# Altium schematic sheet Block Diagram.SchDoc: Gimbal - Block Diagram
size Letter; DrawnBy: Aidan Gratton; Organization: UW Robotics; Address1: 200 University Avenue; Address2: Waterloo; Address3: Ontario; Address4: Canada N2L 3G6; SheetNumber: 1
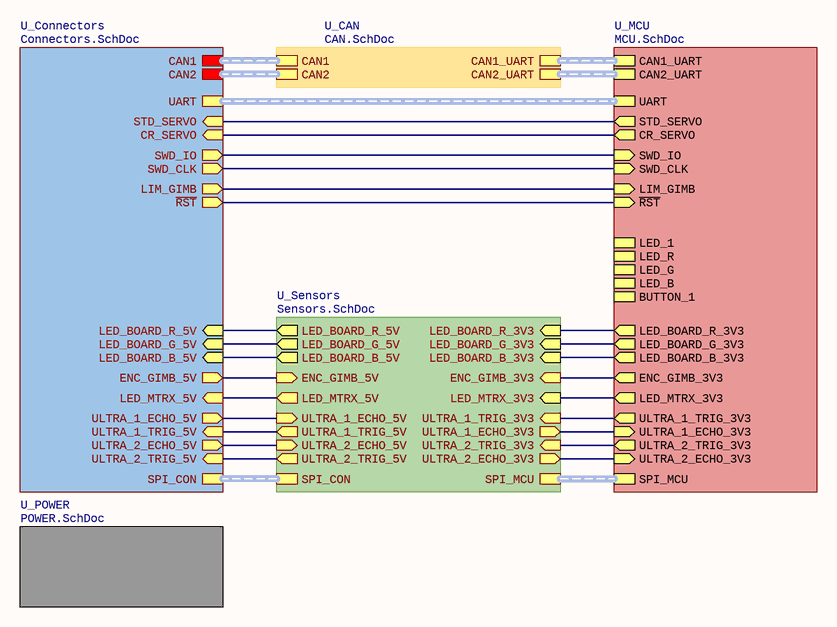
[diagram p0: Block Diagram.SchDoc]

## Sub-sheets
U_CAN = CAN.SchDoc: CAN1 (harness CAN1), CAN2 (harness CAN2), CAN2_UART (harness CAN2_UART), CAN1_UART (harness CAN1_UART)
U_Connectors = Connectors.SchDoc: ~{RST} (out), LIM_GIMB (out), LED_MTRX_5V (in), CAN1 (harness CAN1), CAN2 (harness CAN2), UART (harness UART), SPI_CON (harness SPI_CON), ENC_GIMB_5V (out), ULTRA_1_ECHO_5V (out), ULTRA_1_TRIG_5V (in), ULTRA_2_ECHO_5V (out), ULTRA_2_TRIG_5V (in), STD_SERVO (in), CR_SERVO (in), SWD_IO (out), SWD_CLK (out), LED_BOARD_R_5V (in), LED_BOARD_G_5V (in), LED_BOARD_B_5V (in)
U_MCU = MCU.SchDoc: ~{RST} (in), ENC_GIMB_3V3 (out), LIM_GIMB (in), UART (harness UART), CAN1_UART (harness CAN1_UART), CAN2_UART (harness CAN2_UART), SPI_MCU (harness SPI), LED_MTRX_3V3 (out), ULTRA_1_TRIG_3V3 (out), ULTRA_1_ECHO_3V3 (in), ULTRA_2_TRIG_3V3 (out), ULTRA_2_ECHO_3V3 (in), LED_1, LED_R, LED_G, LED_B, BUTTON_1, STD_SERVO (out), CR_SERVO (out), SWD_IO (in), SWD_CLK (in), LED_BOARD_R_3V3 (out), LED_BOARD_G_3V3 (out), LED_BOARD_B_3V3 (out)
U_POWER = POWER.SchDoc: no entries
U_Sensors = Sensors.SchDoc: ENC_GIMB_3V3 (in), SPI_MCU (harness SPI), SPI_CON (harness SPI_CON), ENC_GIMB_5V (in), ULTRA_1_TRIG_3V3 (in), ULTRA_1_ECHO_3V3 (out), ULTRA_2_TRIG_3V3 (in), ULTRA_2_ECHO_3V3 (out), ULTRA_1_ECHO_5V (in), ULTRA_1_TRIG_5V (out), ULTRA_2_ECHO_5V (in), ULTRA_2_TRIG_5V (out), LED_MTRX_5V (out), LED_MTRX_3V3 (in), LED_BOARD_R_3V3 (in), LED_BOARD_G_3V3 (in), LED_BOARD_B_3V3 (in), LED_BOARD_B_5V (out), LED_BOARD_G_5V (out), LED_BOARD_R_5V (out)

## Nets
(unnamed): sheet U_Connectors/~{RST}, sheet U_MCU/~{RST}
(unnamed): sheet U_Connectors/LIM_GIMB, sheet U_MCU/LIM_GIMB
(unnamed): sheet U_Connectors/LED_MTRX_5V, sheet U_Sensors/LED_MTRX_5V
(unnamed): sheet U_Connectors/ENC_GIMB_5V, sheet U_Sensors/ENC_GIMB_5V
(unnamed): sheet U_Connectors/ULTRA_1_ECHO_5V, sheet U_Sensors/ULTRA_1_ECHO_5V
(unnamed): sheet U_Connectors/ULTRA_1_TRIG_5V, sheet U_Sensors/ULTRA_1_TRIG_5V
(unnamed): sheet U_Connectors/ULTRA_2_ECHO_5V, sheet U_Sensors/ULTRA_2_ECHO_5V
(unnamed): sheet U_Connectors/ULTRA_2_TRIG_5V, sheet U_Sensors/ULTRA_2_TRIG_5V
(unnamed): sheet U_Connectors/STD_SERVO, sheet U_MCU/STD_SERVO
(unnamed): sheet U_Connectors/CR_SERVO, sheet U_MCU/CR_SERVO
(unnamed): sheet U_Connectors/SWD_IO, sheet U_MCU/SWD_IO
(unnamed): sheet U_Connectors/SWD_CLK, sheet U_MCU/SWD_CLK
(unnamed): sheet U_Connectors/LED_BOARD_R_5V, sheet U_Sensors/LED_BOARD_R_5V
(unnamed): sheet U_Connectors/LED_BOARD_G_5V, sheet U_Sensors/LED_BOARD_G_5V
(unnamed): sheet U_Connectors/LED_BOARD_B_5V, sheet U_Sensors/LED_BOARD_B_5V
(unnamed): sheet U_MCU/ENC_GIMB_3V3, sheet U_Sensors/ENC_GIMB_3V3
(unnamed): sheet U_MCU/LED_MTRX_3V3, sheet U_Sensors/LED_MTRX_3V3
(unnamed): sheet U_MCU/ULTRA_1_TRIG_3V3, sheet U_Sensors/ULTRA_1_TRIG_3V3
(unnamed): sheet U_MCU/ULTRA_1_ECHO_3V3, sheet U_Sensors/ULTRA_1_ECHO_3V3
(unnamed): sheet U_MCU/ULTRA_2_TRIG_3V3, sheet U_Sensors/ULTRA_2_TRIG_3V3
(unnamed): sheet U_MCU/ULTRA_2_ECHO_3V3, sheet U_Sensors/ULTRA_2_ECHO_3V3
(unnamed): sheet U_MCU/LED_BOARD_R_3V3, sheet U_Sensors/LED_BOARD_R_3V3
(unnamed): sheet U_MCU/LED_BOARD_G_3V3, sheet U_Sensors/LED_BOARD_G_3V3
(unnamed): sheet U_MCU/LED_BOARD_B_3V3, sheet U_Sensors/LED_BOARD_B_3V3

## Buses and harness runs
harness sheet U_CAN/CAN1 = sheet U_Connectors/CAN1
harness sheet U_CAN/CAN1_UART = sheet U_MCU/CAN1_UART
harness sheet U_CAN/CAN2 = sheet U_Connectors/CAN2
harness sheet U_CAN/CAN2_UART = sheet U_MCU/CAN2_UART
harness sheet U_Connectors/SPI_CON = sheet U_Sensors/SPI_CON
harness sheet U_Connectors/UART = sheet U_MCU/UART
harness sheet U_MCU/SPI_MCU = sheet U_Sensors/SPI_MCU

## Notes on the sheet
- Title
- Size:
- Date:
- Letter
- Drawn By:
- Sheet
- of
- File: